# Altium schematic sheet Single_Mux.SchDoc
size A; DocumentNumber: 5; SheetNumber: 5; SheetTotal: 5
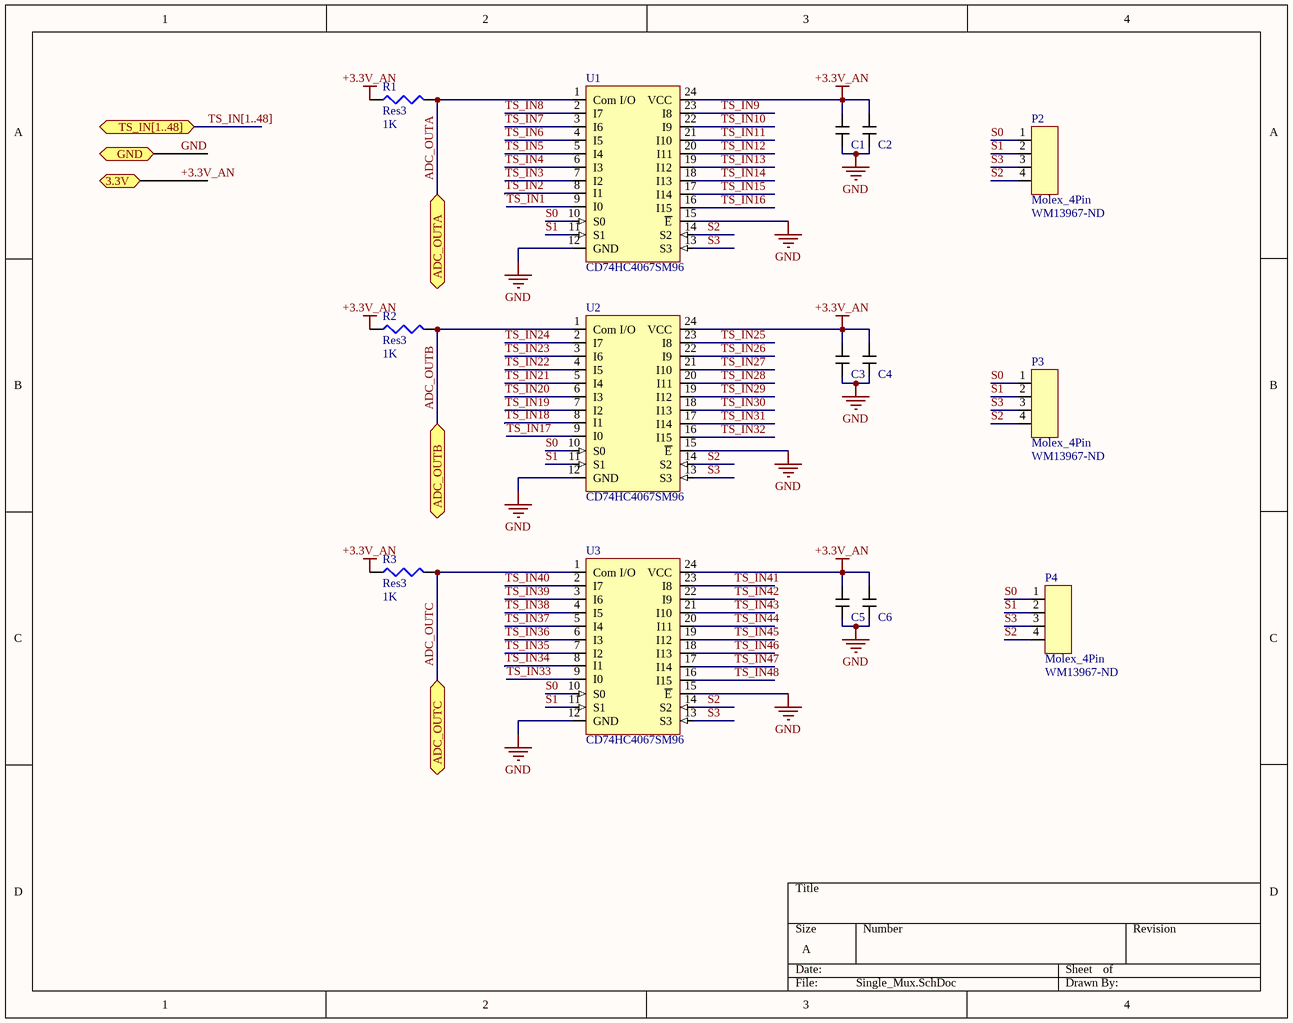
[diagram p0: Single_Mux.SchDoc]

## Parts
C1  0.1uF Cap  [0.1uF_Kemet]  (value not drawn)
C2  1uF Samsung Cap  [1uf_Samsung]  (value not drawn)
C3  0.1uF Cap  [0.1uF_Kemet]  (value not drawn)
C4  1uF Samsung Cap  [1uf_Samsung]  (value not drawn)
C5  0.1uF Cap  [0.1uF_Kemet]  (value not drawn)
C6  1uF Samsung Cap  [1uf_Samsung]  (value not drawn)
P2  Molex_4Pin  Supplier Part Number 1: WM13967-ND  [MUX_SEL_CON]
P3  Molex_4Pin  Supplier Part Number 1: WM13967-ND  [MUX_SEL_CON]
P4  Molex_4Pin  Supplier Part Number 1: WM13967-ND  [MUX_SEL_CON]
R1  Res3  value 1K  [J1-0603]
R2  Res3  value 1K  [J1-0603]
R3  Res3  value 1K  [J1-0603]
U1  CD74HC4067SM96  [SOIC-24_MUX]
U2  CD74HC4067SM96  [SOIC-24_MUX]
U3  CD74HC4067SM96  [SOIC-24_MUX]

## Ports
3.3V (bidir), ADC_OUTA (bidir), ADC_OUTB (bidir), ADC_OUTC (bidir), GND (bidir), TS_IN[1..48] (bidir)

## Nets
+3.3V_AN: C1.2 C2.2 C3.2 C4.2 C5.2 C6.2 R1.1 R2.1 R3.1 U1.24(VCC) U2.24(VCC) U3.24(VCC) ; port 3.3V
GND: C1.1 C2.1 C3.1 C4.1 C5.1 C6.1 U1.12(GND) U1.15(~{E}) U2.12(GND) U2.15(~{E}) U3.12(GND) U3.15(~{E}) ; port GND
ADC_OUTA: R1.2 U1.1(Com_I/O) ; port ADC_OUTA
ADC_OUTB: R2.2 U2.1(Com_I/O) ; port ADC_OUTB
ADC_OUTC: R3.2 U3.1(Com_I/O) ; port ADC_OUTC
S0: P2.1 P3.1 P4.1 U1.10(S0) U2.10(S0) U3.10(S0)
S1: P2.2 P3.2 P4.2 U1.11(S1) U2.11(S1) U3.11(S1)
S2: P2.4 P3.4 P4.4 U1.14(S2) U2.14(S2) U3.14(S2)
S3: P2.3 P3.3 P4.3 U1.13(S3) U2.13(S3) U3.13(S3)
TS_IN1: U1.9(I0)
TS_IN2: U1.8(I1)
TS_IN3: U1.7(I2)
TS_IN4: U1.6(I3)
TS_IN5: U1.5(I4)
TS_IN6: U1.4(I5)
TS_IN7: U1.3(I6)
TS_IN8: U1.2(I7)
TS_IN9: U1.23(I8)
TS_IN10: U1.22(I9)
TS_IN11: U1.21(I10)
TS_IN12: U1.20(I11)
TS_IN13: U1.19(I12)
TS_IN14: U1.18(I13)
TS_IN15: U1.17(I14)
TS_IN16: U1.16(I15)
TS_IN17: U2.9(I0)
TS_IN18: U2.8(I1)
TS_IN19: U2.7(I2)
TS_IN20: U2.6(I3)
TS_IN21: U2.5(I4)
TS_IN22: U2.4(I5)
TS_IN23: U2.3(I6)
TS_IN24: U2.2(I7)
TS_IN25: U2.23(I8)
TS_IN26: U2.22(I9)
TS_IN27: U2.21(I10)
TS_IN28: U2.20(I11)
TS_IN29: U2.19(I12)
TS_IN30: U2.18(I13)
TS_IN31: U2.17(I14)
TS_IN32: U2.16(I15)
TS_IN33: U3.9(I0)
TS_IN34: U3.8(I1)
TS_IN35: U3.7(I2)
TS_IN36: U3.6(I3)
TS_IN37: U3.5(I4)
TS_IN38: U3.4(I5)
TS_IN39: U3.3(I6)
TS_IN40: U3.2(I7)
TS_IN41: U3.23(I8)
TS_IN42: U3.22(I9)
TS_IN43: U3.21(I10)
TS_IN44: U3.20(I11)
TS_IN45: U3.19(I12)
TS_IN46: U3.18(I13)
TS_IN47: U3.17(I14)
TS_IN48: U3.16(I15)

## Buses and harness runs
bus TS_IN[1..48] = port TS_IN[1..48]

## Library data of the parts
C1 C3 C5 = 0.1uF Cap: C0603C101K8GAC7867 Kemet Capacitor; Supplier 1: Digi-Key; Supplier Part Number 1: 399-14477-1-ND
P2-P4 = Component_1: Supplier 1: Digi-Key
R1-R3 = Res3: Resistor; Published: 8-Jun-2000; LatestRevisionDate: 29-May-2009; LatestRevisionNote: IPC-7351 Footprint Added.; PackageReference: J1-0603; Publisher: Altium Limited; PackageDescription: Chip Resistor
C2 C4 C6 = 1uF Samsung Cap: Supplier 1: Digi-Key; Supplier Part Number 1: 1276-1946-1-ND
U1-U3 = CD74HC4067SM96: Supplier Part Number 1: 05B6161; Supplier 1: Newark